# Altium project BW2098POE.PrjPcb (part 1 of 8)
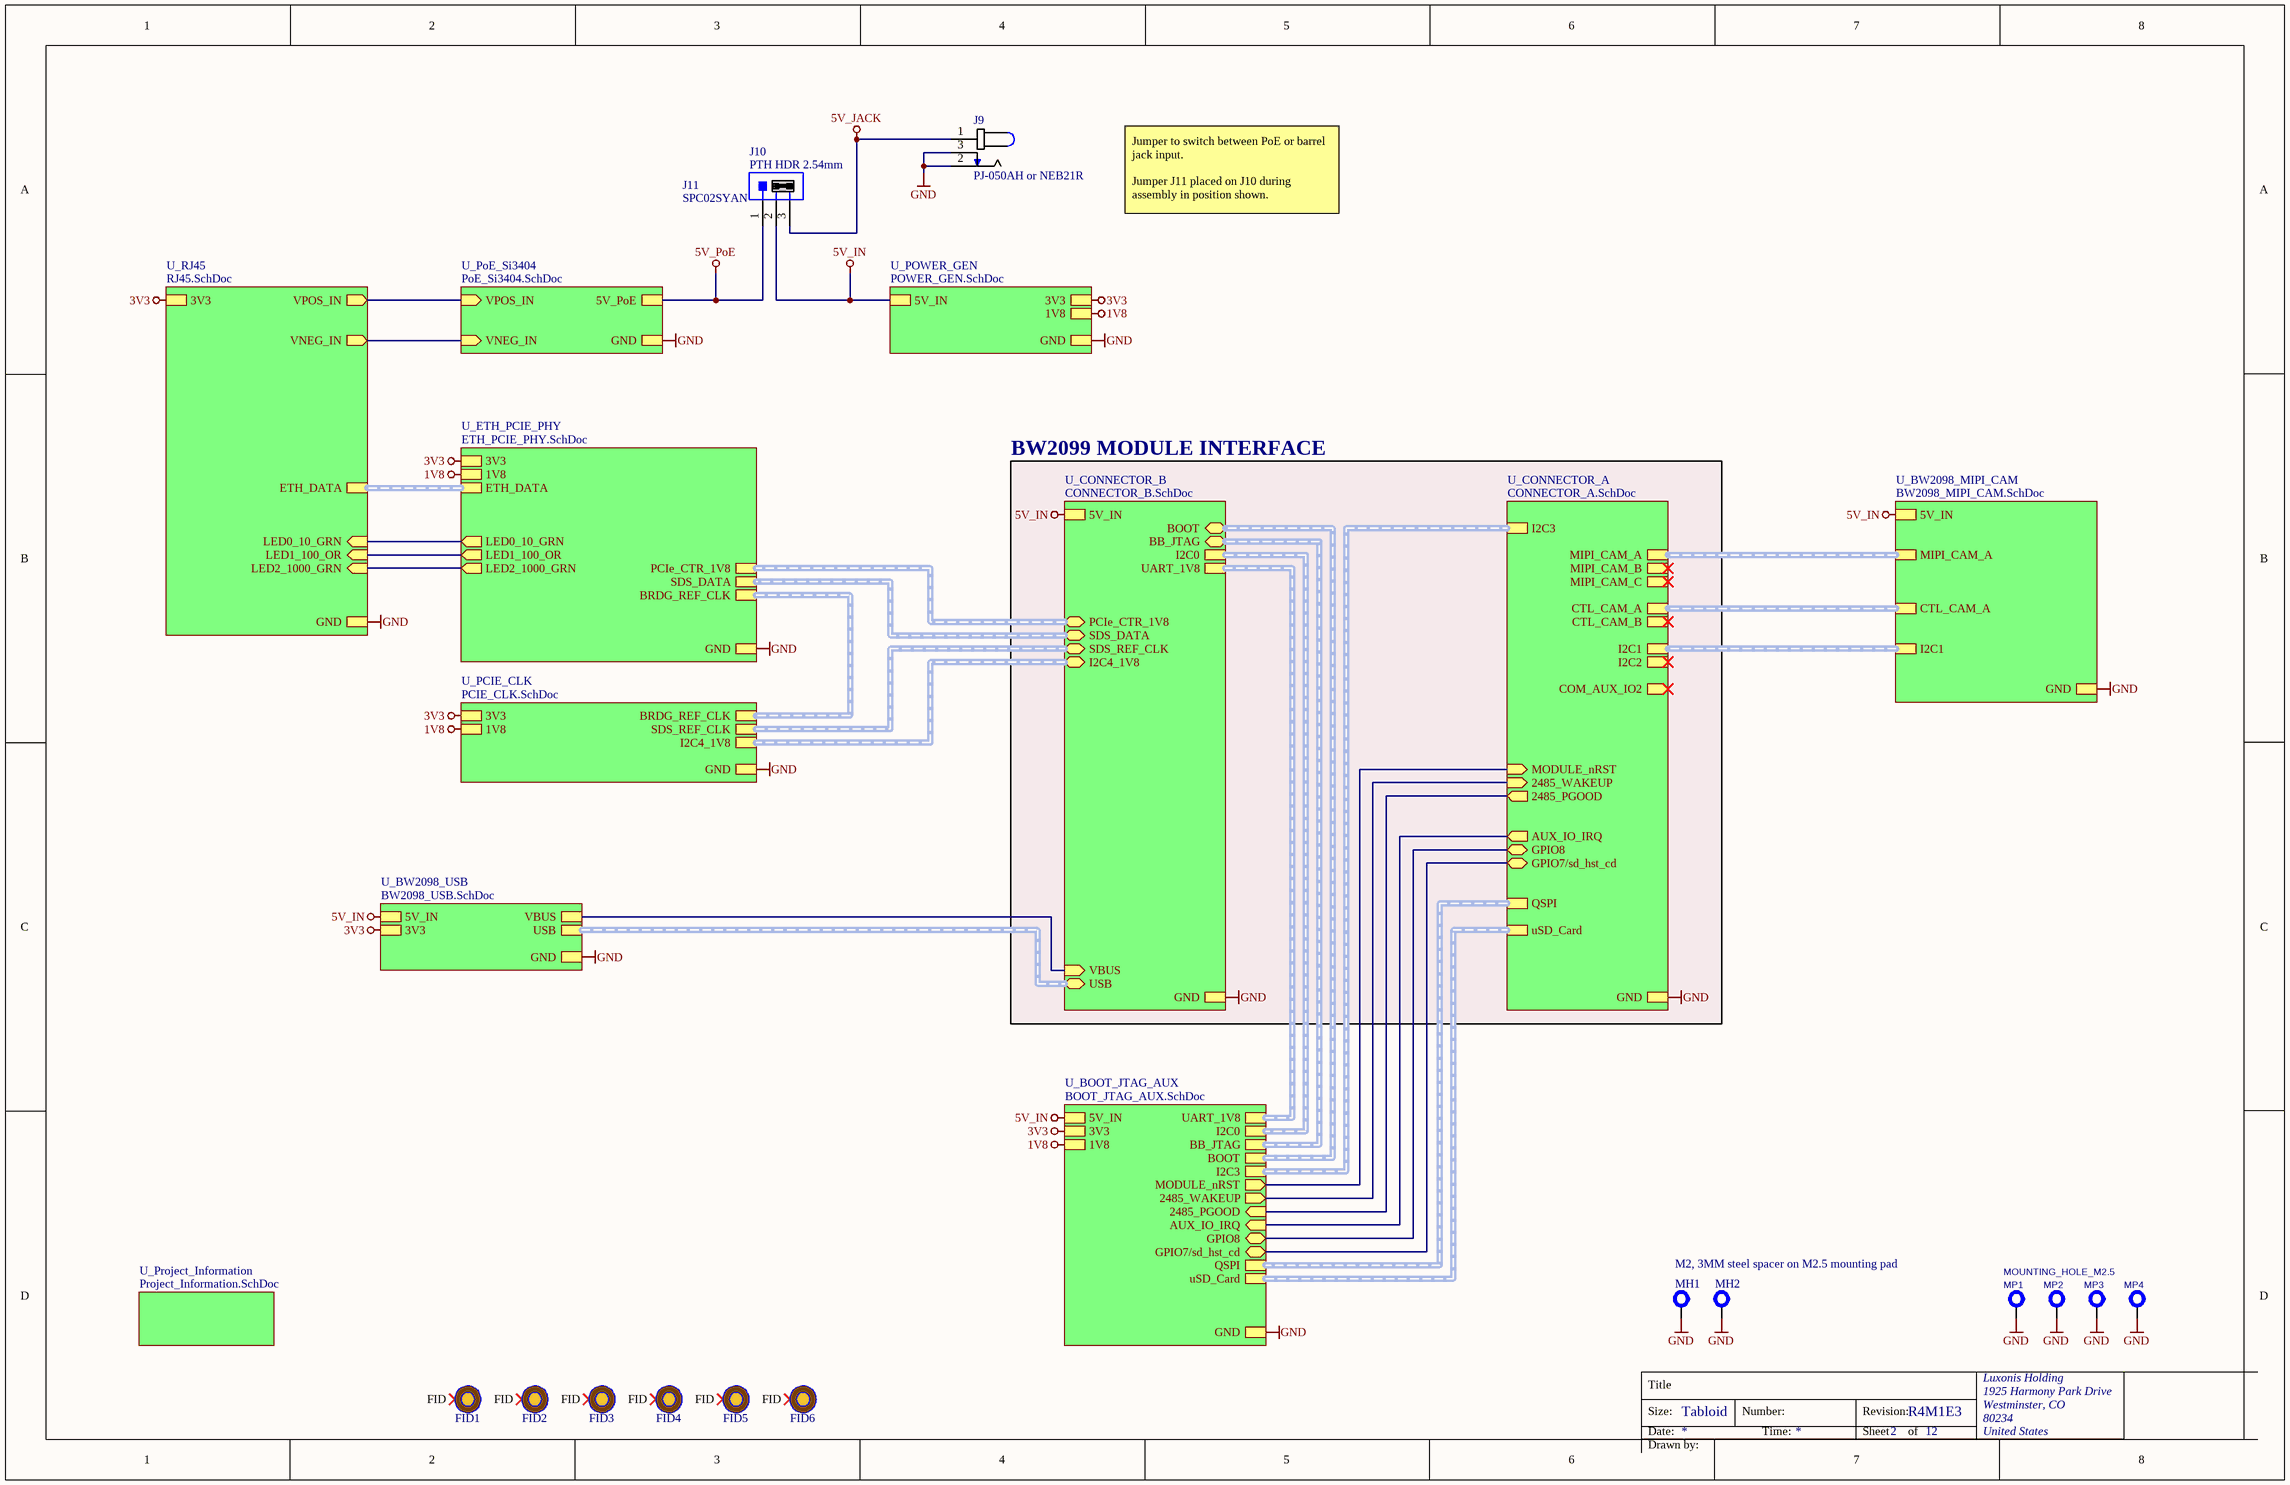
[diagram p0: TopLevel.SchDoc]
document_number: D2098000; drawn_by: Brian Weinstein; project_title: BW2098POE; revision: R4M1E3
12 sheets, 236 parts. Net scope: strictly hierarchical (ports join the sheet entries above them; power ports are local).
Board file: BW2098POE.PcbDoc
Sheets:
  TopLevel.SchDoc
    U_Project_Information = Project_Information.SchDoc
    U_CONNECTOR_B = CONNECTOR_B.SchDoc
    U_CONNECTOR_A = CONNECTOR_A.SchDoc
    U_ETH_PCIE_PHY = ETH_PCIE_PHY.SchDoc
    U_RJ45 = RJ45.SchDoc
    U_PCIE_CLK = PCIE_CLK.SchDoc
    U_BW2098_MIPI_CAM = BW2098_MIPI_CAM.SchDoc
    U_BW2098_USB = BW2098_USB.SchDoc
    U_BOOT_JTAG_AUX = BOOT_JTAG_AUX.SchDoc
    U_PoE_Si3404 = PoE_Si3404.SchDoc
    U_POWER_GEN = POWER_GEN.SchDoc

## Sheet TopLevel.SchDoc: =project_title
size Tabloid; CompanyName: Luxonis Holding; DrawnBy: Brian Weinstein; Organization: Luxonis Holding; Address1: 1925 Harmony Park Drive; Address2: Westminster, CO; Address3: 80234; Address4: United States; DocumentNumber: D2098000; Revision: R4M1E3; SheetNumber: 2; SheetTotal: 12

### Parts
FID1  FIDUCIAL_ROUND_1MM  [FIDUCIAL_ROUND_1MM]  (value not drawn)  (no BOM)
FID2  FIDUCIAL_ROUND_1MM  [FIDUCIAL_ROUND_1MM]  (value not drawn)  (no BOM)
FID3  FIDUCIAL_ROUND_1MM  [FIDUCIAL_ROUND_1MM]  (value not drawn)  (no BOM)
FID4  FIDUCIAL_ROUND_1MM  [FIDUCIAL_ROUND_1MM]  (value not drawn)  (no BOM)
FID5  FIDUCIAL_ROUND_1MM  [FIDUCIAL_ROUND_1MM]  (value not drawn)  (no BOM)
FID6  FIDUCIAL_ROUND_1MM  [FIDUCIAL_ROUND_1MM]  (value not drawn)  (no BOM)
J9  PJ-050AH or NEB21R  [PJ-050AH/NEB21R_COMBO]
J10  PTH HDR 2.54mm  [68000-103HLF]
J11  SPC02SYAN  [SPC02SYAN]
MH1  M2, 3MM steel spacer on M2.5 mounting pad  [9774030243R]
MH2  M2, 3MM steel spacer on M2.5 mounting pad  [9774030243R]  (value not drawn)
MP1  MOUNTING_HOLE_M2.5  [MOUNTING_HOLE_M2.5]  (no BOM)
MP2  MOUNTING_HOLE_M2.5  [MOUNTING_HOLE_M2.5]  (value not drawn)  (no BOM)
MP3  MOUNTING_HOLE_M2.5  [MOUNTING_HOLE_M2.5]  (value not drawn)  (no BOM)
MP4  MOUNTING_HOLE_M2.5  [MOUNTING_HOLE_M2.5]  (value not drawn)  (no BOM)

### Sub-sheets
U_BOOT_JTAG_AUX = BOOT_JTAG_AUX.SchDoc: GPIO8 (bidir), AUX_IO_IRQ (in), BOOT (harness BOOT), BB_JTAG (harness BB_JTAG), uSD_Card (harness uSD_Card), 2485_WAKEUP (out), QSPI (harness QSPI), I2C3 (harness I2C3), MODULE_nRST (out), UART_1V8 (harness UART_1V8), 2485_PGOOD (in), 1V8, 3V3, GND, 5V_IN, I2C0 (harness I2C0), GPIO7/sd_hst_cd (bidir)
U_BW2098_MIPI_CAM = BW2098_MIPI_CAM.SchDoc: I2C1 (harness I2C1), MIPI_CAM_A (harness MIPI_CAM_A), GND, 5V_IN, CTL_CAM_A (harness CTL_CAM_A)
U_BW2098_USB = BW2098_USB.SchDoc: USB (harness USB), GND, 5V_IN, 3V3, VBUS
U_CONNECTOR_A = CONNECTOR_A.SchDoc: AUX_IO_IRQ (out), I2C2 (harness I2C2), I2C1 (harness I2C1), QSPI (harness QSPI), uSD_Card (harness uSD_Card), MIPI_CAM_C (harness MIPI_CAM_C), CTL_CAM_A (harness CTL_CAM_A), MIPI_CAM_A (harness MIPI_CAM_A), MIPI_CAM_B (harness MIPI_CAM_B), GPIO8 (bidir), GND, I2C3 (harness I2C3), CTL_CAM_B (harness CTL_CAM_B), COM_AUX_IO2 (out), MODULE_nRST (in), 2485_WAKEUP (in), 2485_PGOOD (out), GPIO7/sd_hst_cd (bidir)
U_CONNECTOR_B = CONNECTOR_B.SchDoc: VBUS (in), UART_1V8 (harness UART_1V8), I2C0 (harness I2C0), 5V_IN, GND, BOOT (bidir, harness BOOT), PCIe_CTR_1V8 (bidir, harness PCIe_CTR_1V8), BB_JTAG (bidir, harness BB_JTAG), USB (bidir, harness USB), SDS_REF_CLK (bidir, harness SDS_REF_CLK), I2C4_1V8 (bidir, harness I2C4_1V8), SDS_DATA (bidir, harness Harness)
U_ETH_PCIE_PHY = ETH_PCIE_PHY.SchDoc: ETH_DATA (harness ETH_DATA), LED0_10_GRN (out), LED1_100_OR (out), LED2_1000_GRN (out), SDS_DATA (harness Harness), 3V3, GND, BRDG_REF_CLK (harness BRDG_REF_CLK), 1V8, PCIe_CTR_1V8 (harness PCIe_CTR_1V8)
U_PCIE_CLK = PCIE_CLK.SchDoc: BRDG_REF_CLK (harness BRDG_REF_CLK), SDS_REF_CLK (harness SDS_REF_CLK), GND, 3V3, 1V8, I2C4_1V8 (harness I2C4_1V8)
U_PoE_Si3404 = PoE_Si3404.SchDoc: 5V_PoE, GND, VPOS_IN (in), VNEG_IN (in)
U_POWER_GEN = POWER_GEN.SchDoc: GND, 3V3, 5V_IN, 1V8
U_Project_Information = Project_Information.SchDoc: no entries
U_RJ45 = RJ45.SchDoc: ETH_DATA (harness ETH_DATA), GND, LED0_10_GRN (in), 3V3, LED2_1000_GRN (in), LED1_100_OR (in), VPOS_IN (out), VNEG_IN (out)

### Nets
1V8: sheet U_ETH_PCIE_PHY/1V8, sheet U_PCIE_CLK/1V8, sheet U_BOOT_JTAG_AUX/1V8, sheet U_POWER_GEN/1V8
3V3: sheet U_ETH_PCIE_PHY/3V3, sheet U_RJ45/3V3, sheet U_PCIE_CLK/3V3, sheet U_BW2098_USB/3V3, sheet U_BOOT_JTAG_AUX/3V3, sheet U_POWER_GEN/3V3
5V_IN: J10.2 ; sheet U_CONNECTOR_B/5V_IN, sheet U_BW2098_MIPI_CAM/5V_IN, sheet U_BW2098_USB/5V_IN, sheet U_BOOT_JTAG_AUX/5V_IN, sheet U_POWER_GEN/5V_IN
5V_JACK: J9.1 J10.3
5V_PoE: J10.1 ; sheet U_PoE_Si3404/5V_PoE
GND: J9.2 J9.3 MH1.1 MH2.1 MP1.1 MP2.1 MP3.1 MP4.1 ; sheet U_CONNECTOR_B/GND, sheet U_CONNECTOR_A/GND, sheet U_ETH_PCIE_PHY/GND, sheet U_RJ45/GND, sheet U_PCIE_CLK/GND, sheet U_BW2098_MIPI_CAM/GND, sheet U_BW2098_USB/GND, sheet U_BOOT_JTAG_AUX/GND, sheet U_PoE_Si3404/GND, sheet U_POWER_GEN/GND
VBUS: sheet U_CONNECTOR_B/VBUS, sheet U_BW2098_USB/VBUS
VNEG_IN: sheet U_RJ45/VNEG_IN, sheet U_PoE_Si3404/VNEG_IN
2485_PGOOD: sheet U_CONNECTOR_A/2485_PGOOD, sheet U_BOOT_JTAG_AUX/2485_PGOOD
2485_WAKEUP: sheet U_CONNECTOR_A/2485_WAKEUP, sheet U_BOOT_JTAG_AUX/2485_WAKEUP
AUX_IO_IRQ: sheet U_CONNECTOR_A/AUX_IO_IRQ, sheet U_BOOT_JTAG_AUX/AUX_IO_IRQ
GPIO7/sd_hst_cd: sheet U_CONNECTOR_A/GPIO7/sd_hst_cd, sheet U_BOOT_JTAG_AUX/GPIO7/sd_hst_cd
GPIO8: sheet U_CONNECTOR_A/GPIO8, sheet U_BOOT_JTAG_AUX/GPIO8
LED0_10_GRN: sheet U_ETH_PCIE_PHY/LED0_10_GRN, sheet U_RJ45/LED0_10_GRN
LED1_100_OR: sheet U_ETH_PCIE_PHY/LED1_100_OR, sheet U_RJ45/LED1_100_OR
LED2_1000_GRN: sheet U_ETH_PCIE_PHY/LED2_1000_GRN, sheet U_RJ45/LED2_1000_GRN
MODULE_nRST: sheet U_CONNECTOR_A/MODULE_nRST, sheet U_BOOT_JTAG_AUX/MODULE_nRST
VPOS_IN: sheet U_RJ45/VPOS_IN, sheet U_PoE_Si3404/VPOS_IN

Not connected (* = marked no-connect by the designer): FID1 FID*; FID2 FID*; FID3 FID*; FID4 FID*; FID5 FID*; FID6 FID*

### Buses and harness runs
harness sheet U_BOOT_JTAG_AUX/BB_JTAG = sheet U_CONNECTOR_B/BB_JTAG
harness sheet U_BOOT_JTAG_AUX/BOOT = sheet U_CONNECTOR_B/BOOT
harness sheet U_BOOT_JTAG_AUX/I2C0 = sheet U_CONNECTOR_B/I2C0
harness sheet U_BOOT_JTAG_AUX/I2C3 = sheet U_CONNECTOR_A/I2C3
harness sheet U_BOOT_JTAG_AUX/QSPI = sheet U_CONNECTOR_A/QSPI
harness sheet U_BOOT_JTAG_AUX/UART_1V8 = sheet U_CONNECTOR_B/UART_1V8
harness sheet U_BOOT_JTAG_AUX/uSD_Card = sheet U_CONNECTOR_A/uSD_Card
harness sheet U_BW2098_MIPI_CAM/CTL_CAM_A = sheet U_CONNECTOR_A/CTL_CAM_A
harness sheet U_BW2098_MIPI_CAM/I2C1 = sheet U_CONNECTOR_A/I2C1
harness sheet U_BW2098_MIPI_CAM/MIPI_CAM_A = sheet U_CONNECTOR_A/MIPI_CAM_A
harness sheet U_BW2098_USB/USB = sheet U_CONNECTOR_B/USB
harness sheet U_CONNECTOR_B/I2C4_1V8 = sheet U_PCIE_CLK/I2C4_1V8
harness sheet U_CONNECTOR_B/PCIe_CTR_1V8 = sheet U_ETH_PCIE_PHY/PCIe_CTR_1V8
harness sheet U_CONNECTOR_B/SDS_DATA = sheet U_ETH_PCIE_PHY/SDS_DATA
harness sheet U_CONNECTOR_B/SDS_REF_CLK = sheet U_PCIE_CLK/SDS_REF_CLK
harness sheet U_ETH_PCIE_PHY/BRDG_REF_CLK = sheet U_PCIE_CLK/BRDG_REF_CLK
harness sheet U_ETH_PCIE_PHY/ETH_DATA = sheet U_RJ45/ETH_DATA

### Notes on the sheet
- Jumper to switch between PoE or barrel jack input.
  Jumper J11 placed on J10 during assembly in position shown.
- BW2099 MODULE INTERFACE
- Title
- Size:
- Date:
- Tabloid
- Number:
- Time:
- Revision:
- Sheet
- of
- Drawn by:

### Library data of the parts
FID1-FID6 = FIDUCIAL: Fiducial with various available footprints
J9 = PJ-050AH/NEB21R_COMBO: CONN POWER PIN 2 POS RA PTH Barrel jack 2.1mm x 5.5mm combo footprint; Manufacturer 1: CUI; Gender: Male; Shielding: Unshielded; Current Rating: 5A; Voltage Rating: 24V; Insulation Resistance: 100MR; Number of Conductors: 2; Max Current Rating: 3A; Voltage Rating (DC): 12V; Number of Ports: 1; Inside Diameter: 6mm; Supplier 1: Mouser; Manufacturer Part Number 1: PJ-050AH; Stock 1: 2665; Pricing 1: 1=0.78000, 10=0.68800, 50=0.62100, 100=0.59400, 1000=0.43200, 10000=0.39100 (USD); Mount: Through Hole; Color: Black; Contact Material: Copper; Contact Plating: Nickel; Housing Color: Black; Housing Material: Thermoplastic; Min Operating Temperature: -25°C; Max Operating Temperature: 85°C; Package Quantity: 500; Termination: Solder; Connector Type: Jack; Contact Gender: Male; Orientation: Horizontal; Lead Free: Lead Free; Flammability Rating: UL94 V-0; ComponentLink1URL: http://www.mouser.com/ds/2/670/PJ-050AH-524150.pdf?src-supplier=Mouser; ComponentLink1Description: http://www.mouser.com/ds/2/670/PJ-050AH-524150.pdf?src-supplier=Mouser; ComponentLink2URL: https://www.cui.com/product/resource/digikeypdf/pj-050ah.pdf?src-supplier=Digi-Key; ComponentLink2Description: https://www.cui.com/product/resource/digikeypdf/pj-050ah.pdf?src-supplier=Digi-Key; ComponentLink3URL: http://datasheet.octopart.com/PJ-050AH-CUI-datasheet-15696426.pdf?src-supplier=CUI; ComponentLink3Description: http://datasheet.octopart.com/PJ-050AH-CUI-datasheet-15696426.pdf?src-supplier=CUI; ComponentLink4URL: http://datasheet.octopart.com/PJ-050AH-CUI-datasheet-62089837.pdf?src-supplier=CUI; ComponentLink4Description: http://datasheet.octopart.com/PJ-050AH-CUI-datasheet-62089837.pdf?src-supplier=CUI; ComponentLink5URL: http://datasheet.octopart.com/PJ-050AH-CUI-datasheet-65972796.pdf?src-supplier=CUI; ComponentLink5Description: http://datasheet.octopart.com/PJ-050AH-CUI-datasheet-65972796.pdf?src-supplier=CUI; ComponentLink6URL: http://datasheet.octopart.com/PJ-050AH-CUI-datasheet-103766550.pdf?src-supplier=CUI; ComponentLink6Description: http://datasheet.octopart.com/PJ-050AH-CUI-datasheet-103766550.pdf?src-supplier=CUI; ComponentLink7URL: http://datasheet.octopart.com/PJ-050AH-CUI-datasheet-103111417.pdf?src-supplier=Electro+Sonic; ComponentLink7Description: http://datasheet.octopart.com/PJ-050AH-CUI-datasheet-103111417.pdf?src-supplier=Electro+Sonic; ComponentLink8URL: http://datasheet.octopart.com/PJ-050AH-CUI-datasheet-34390405.pdf?src-supplier=Future+Electronics; ComponentLink8Description: http://datasheet.octopart.com/PJ-050AH-CUI-datasheet-34390405.pdf?src-supplier=Future+Electronics; ComponentLink9URL: http://datasheet.octopart.com/PJ-050AH-CUI-datasheet-62073522.pdf?src-supplier=Future+Electronics; ComponentLink9Description: http://datasheet.octopart.com/PJ-050AH-CUI-datasheet-62073522.pdf?src-supplier=Future+Electronics; ComponentLink10URL: http://datasheet.octopart.com/PJ-050AH-CUI-datasheet-102985732.pdf?src-supplier=Future+Electronics; ComponentLink10Description: http://datasheet.octopart.com/PJ-050AH-CUI-datasheet-102985732.pdf?src-supplier=Future+Electronics; Supplier 2: Newark; Manufacturer 2: Lumberg; Manufacturer Part Number 2: NEB 21 R; Stock 2: 56; Pricing 2: 1=0.86400, 25=0.82100, 50=0.78300, 100=0.72900, 250=0.68600 (USD); Number of Pins: 2; Number of Terminals: 3; Packaging: Bulk; Max Voltage Rating (DC): 12V; Voltage Rating (AC): 12V; Length: 9mm; Depth: 14.5mm; REACH SVHC: No SVHC; ComponentLink11URL: https://datasheet.ciiva.com/11720/0900766b805694d6-11720273.pdf?src-supplier=RSComponents; ComponentLink11Description: https://datasheet.ciiva.com/11720/0900766b805694d6-11720273.pdf?src-supplier=RSComponents; ComponentLink12URL: https://datasheet.ciiva.com/1115/28897-1115898.pdf?src-supplier=Newark; ComponentLink12Description: https://datasheet.ciiva.com/1115/28897-1115898.pdf?src-supplier=Newark; ComponentLink13URL: https://datasheet.ciiva.com/8066/1700582-8066298.pdf?src-supplier=Element14; ComponentLink13Description: https://datasheet.ciiva.com/8066/1700582-8066298.pdf?src-supplier=Element14; ComponentLink14URL: https://datasheet.ciiva.com/29365/738882-da-01-ml-netzger-einbaukuppl-neb-21-r-de-en-fr-29365351.pdf?src-supplier=Conrad; ComponentLink14Description: https://datasheet.ciiva.com/29365/738882-da-01-ml-netzger-einbaukuppl-neb-21-r-de-en-fr-29365351.pdf?src-supplier=Conrad; ComponentLink15URL: http://datasheet.octopart.com/NEB-21-R-Lumberg-datasheet-15206778.pdf?src-supplier=Newark; ComponentLink15Description: http://datasheet.octopart.com/NEB-21-R-Lumberg-datasheet-15206778.pdf?src-supplier=Newark; ComponentLink16URL: http://datasheet.octopart.com/NEB-21-R-Lumberg-datasheet-103789672.pdf?src-supplier=Farnell; ComponentLink16Description: http://datasheet.octopart.com/NEB-21-R-Lumberg-datasheet-103789672.pdf?src-supplier=Farnell; ComponentLink17URL: http://datasheet.octopart.com/NEB-21-R-Lumberg-datasheet-136395310.pdf?src-supplier=Toby+Electronics; ComponentLink17Description: http://datasheet.octopart.com/NEB-21-R-Lumberg-datasheet-136395310.pdf?src-supplier=Toby+Electronics; Supplier Part Number 1: 490-PJ-050AH; Supplier Part Number 2: 97K6458; Supplier 3: Digi-Key; Supplier Part Number 3: CP-050AH-ND; Supplier 4: Element14; Supplier Part Number 4: 1217037
J10 = 68000-103HLF: Conn Unshrouded Header HDR 3 POS 2.54mm Solder ST Thru-Hole Bulk; Manufacturer 1: Amphenol FCI; Number of Positions: 3; Connector Type: Male Pin; Current Rating: 3A; Voltage Rating: 1.5kV; Insulation Resistance: 5GR; Gender: Male; Contact Post Length: 2.41mm; Supplier 1: Digi-Key; Manufacturer Part Number 1: 68000-103HLF; RoHS: Yes; Category: Headers and Wire Housings; Stock 1: 28978; Pricing 1: 1=0.29000, 10=0.27900, 100=0.19500, 500=0.16716, 1000=0.13930, 5000=0.11940, 10000=0.11144 (USD); Mount: Through Hole; Contact Plating: Gold,GXT; Contact Material: Bronze; Color: Black; Housing Color: Black; Housing Material: Thermoplastic; Min Operating Temperature: -65°C; Max Operating Temperature: 125°C; Number of Rows: 1; Termination: Through Hole; Packaging: Bulk; Number of Contacts: 3; Contact Gender: Male; Package Quantity: 100; Max Voltage Rating (AC): 1.5kV; Orientation: Straight; Length: 7.62mm; Pitch: 2.54mm; Contact Mating Length: 5.84mm; Depth: 2.41mm; Radiation Hardening: No; Flammability Rating: UL94 V-0; REACH SVHC: No SVHC; ComponentLink1URL: https://datasheet.ciiva.com/5157/68000-274283-5157301.pdf?src-supplier=Mouser; ComponentLink1Description: https://datasheet.ciiva.com/5157/68000-274283-5157301.pdf?src-supplier=Mouser; ComponentLink2URL: https://datasheet.ciiva.com/46392/1914865-46392021.pdf?src-supplier=Element14; ComponentLink2Description: https://datasheet.ciiva.com/46392/1914865-46392021.pdf?src-supplier=Element14; ComponentLink3URL: https://datasheet.ciiva.com/10149/68000-10149754.pdf?src-supplier=Avnet; ComponentLink3Description: https://datasheet.ciiva.com/10149/68000-10149754.pdf?src-supplier=Avnet; Supplier 2: Avnet; Supplier 3: Mouser; Supplier Part Number 1: 609-3461-ND; Supplier Part Number 2: 68000-103HLF; Supplier Part Number 3: 649-68000-103HLF
J11 = SPC02SYAN: CONN JUMPER SHORTING GOLD FLASH; Manufacturer 1: Sullins; Number of Positions: 2; Pitch: 0.1inch; Supplier 1: Digi-Key; Manufacturer Part Number 1: SPC02SYAN; RoHS: Yes; Category: Connectors; Stock 1: 308371; Pricing 1: 1=0.10000, 10=0.05900, 25=0.04400, 50=0.03780, 100=0.03650, 250=0.03152, 500=0.03024, 1000=0.02646, 2500=0.02394 (USD); Color: Black; Contact Plating: Gold; Package Quantity: 1000; Packaging: Bulk; Height: 0.256inch; Lead Free: Lead Free; ComponentLink1URL: https://datasheet.ciiva.com/16203/spc02syan-0-3293-16203044.pdf?src-supplier=Future+Electronics; ComponentLink1Description: https://datasheet.ciiva.com/16203/spc02syan-0-3293-16203044.pdf?src-supplier=Future+Electronics; ComponentLink2URL: https://datasheet.ciiva.com/767/134-c02syan-11134-767878.pdf?src-supplier=Digi-Key; ComponentLink2Description: https://datasheet.ciiva.com/767/134-c02syan-11134-767878.pdf?src-supplier=Digi-Key; Supplier Part Number 1: S9001-ND; Supplier 2: Future Electronics; Supplier Part Number 2: SPC02SYAN-BAG
MH1 MH2 = 9774030243R: MP ROUND STANDOFF M2X0.4 STEEL 3MM; Manufacturer 1: Wurth Electronics; Plating: Tin; Threaded/Unthreaded: Threaded; Outside Diameter: 0.171inch; Supplier 1: Digi-Key; Manufacturer Part Number 1: 9774030243R; Stock 1: 20568; Pricing 1: 1=0.95000, 10=0.91800, 50=0.79500, 100=0.73900 (USD); RoHS: Yes; Material: Steel; Length: 0.173inch; REACH SVHC: Unknown; ComponentLink1URL: http://www.mouser.com/ds/2/445/9774030243R-611455.pdf?src-supplier=Mouser; ComponentLink1Description: http://www.mouser.com/ds/2/445/9774030243R-611455.pdf?src-supplier=Mouser; ComponentLink2URL: http://www.farnell.com/datasheets/1960368.pdf?src-supplier=Farnell; ComponentLink2Description: http://www.farnell.com/datasheets/1960368.pdf?src-supplier=Farnell; ComponentLink3URL: https://katalog.we-online.de/em/datasheet/9774030243R.pdf?src-supplier=Digi-Key; ComponentLink3Description: https://katalog.we-online.de/em/datasheet/9774030243R.pdf?src-supplier=Digi-Key; ComponentLink4URL: http://www.farnell.com/datasheets/1960368.pdf?src-supplier=Newark; ComponentLink4Description: http://www.farnell.com/datasheets/1960368.pdf?src-supplier=Newark; ComponentLink5URL: http://www.farnell.com/datasheets/1960368.pdf?src-supplier=Element14; ComponentLink5Description: http://www.farnell.com/datasheets/1960368.pdf?src-supplier=Element14; Supplier Part Number 1: 732-7085-1-ND; Supplier 2: Mouser; Supplier Part Number 2: 710-9774030243R; Supplier 3: Element14; Supplier Part Number 3: 2497599
MP1-MP4 = MP_Mounting-Holes: =CurrentFootprint; B - Value: Not a Part; A - Level: 0

## Sheet Project_Information.SchDoc: =project_title
size Tabloid; CompanyName: Luxonis Holding; DrawnBy: Brian Weinstein; Organization: Luxonis Holding; Address1: 1925 Harmony Park Drive; Address2: Westminster, CO; Address3: 80234; Address4: United States; DocumentNumber: D2098000; Revision: R4M1E3; SheetNumber: 1; SheetTotal: 12
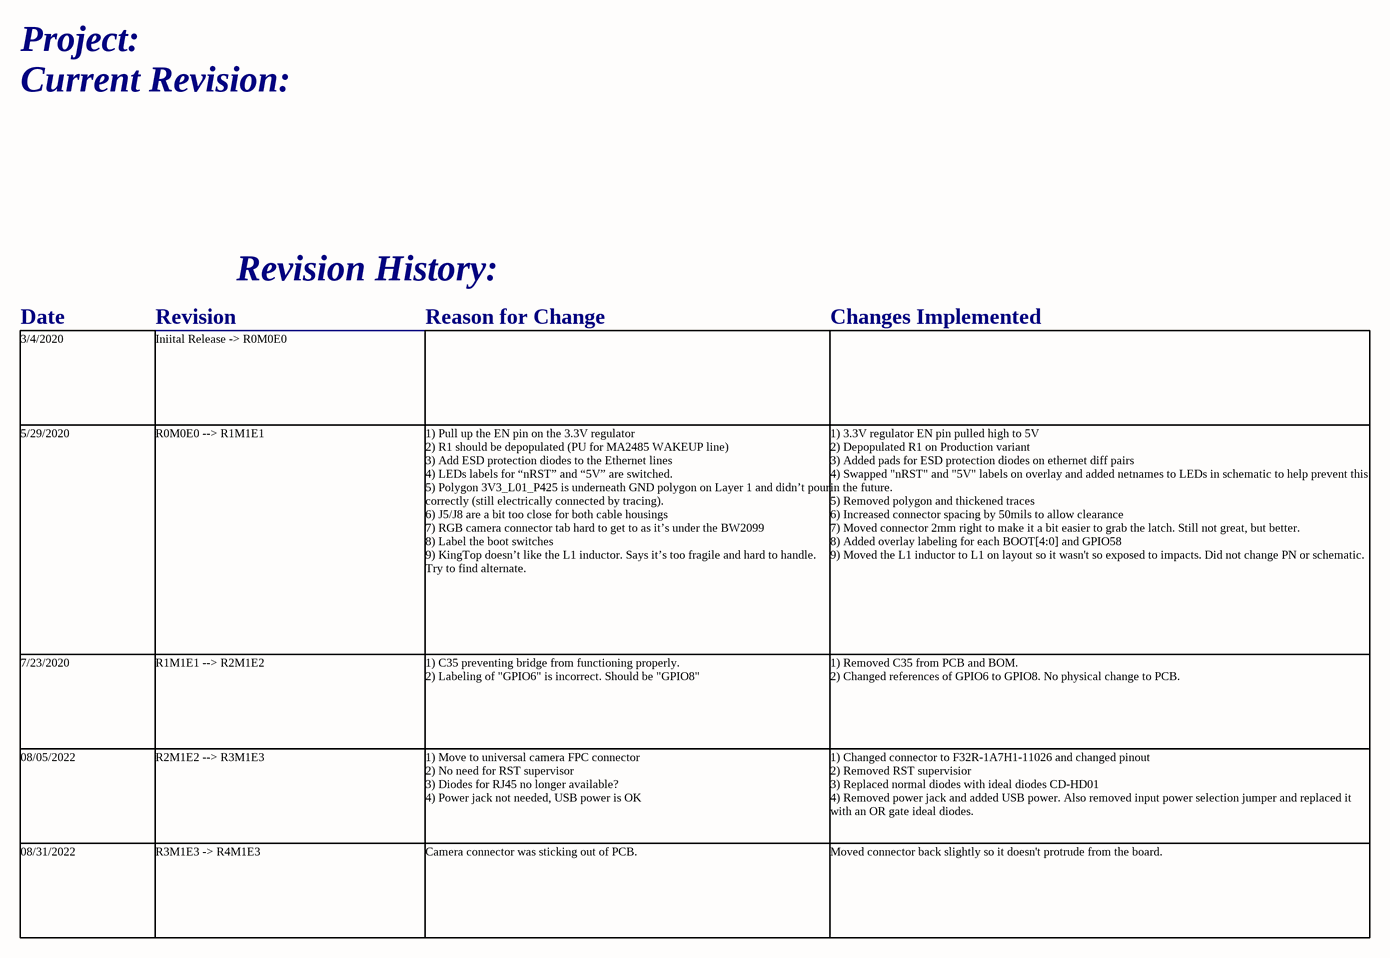
[diagram p1: Project_Information.SchDoc]

### Notes on the sheet
- Project:
- Current Revision:
- Revision History:
- Date
- Revision
- Reason for Change
- Changes Implemented
- 3/4/2020
- Iniital Release -> R0M0E0
- 5/29/2020
- R0M0E0 --> R1M1E1
- 1) Pull up the EN pin on the 3.3V regulator
  2) R1 should be depopulated (PU for MA2485 WAKEUP line)
  3) Add ESD protection diodes to the Ethernet lines
  4) LEDs labels for “nRST” and “5V” are switched.
  5) Polygon 3V3_L01_P425 is underneath GND polygon on Layer 1 and didn’t pour correctly (still electrically connected by tracing).
  6) J5/J8 are a bit too close for both cable housings
  7) RGB camera connector tab hard to get to as it’s under the BW2099
  8) Label the boot switches
  9) KingTop doesn’t like the L1 inductor. Says it’s too fragile and hard to handle. Try to find alternate.
- 1) 3.3V regulator EN pin pulled high to 5V
  2) Depopulated R1 on Production variant
  3) Added pads for ESD protection diodes on ethernet diff pairs
  4) Swapped "nRST" and "5V" labels on overlay and added netnames to LEDs in schematic to help prevent this in the future.
  5) Removed polygon and thickened traces
  6) Increased connector spacing by 50mils to allow clearance
  7) Moved connector 2mm right to make it a bit easier to grab the latch. Still not great, but better.
  8) Added overlay labeling for each BOOT[4:0] and GPIO58
  9) Moved the L1 inductor to L1 on layout so it wasn't so exposed to impacts. Did not change PN or schematic.
- 7/23/2020
- R1M1E1 --> R2M1E2
- 1) C35 preventing bridge from functioning properly.
  2) Labeling of "GPIO6" is incorrect. Should be "GPIO8"
- 1) Removed C35 from PCB and BOM.
  2) Changed references of GPIO6 to GPIO8. No physical change to PCB.
- 08/05/2022
- R2M1E2 --> R3M1E3
- 1) Move to universal camera FPC connector
  2) No need for RST supervisor
  3) Diodes for RJ45 no longer available?
  4) Power jack not needed, USB power is OK
- 1) Changed connector to F32R-1A7H1-11026 and changed pinout
  2) Removed RST supervisior
  3) Replaced normal diodes with ideal diodes CD-HD01
  4) Removed power jack and added USB power. Also removed input power selection jumper and replaced it with an OR gate ideal diodes.
- 08/31/2022
- R3M1E3 -> R4M1E3
- Camera connector was sticking out of PCB.
- Moved connector back slightly so it doesn't protrude from the board.
- Title
- Size:
- Date:
- Tabloid
- Number:
- Time:
- Revision:
- Sheet
- of
- Drawn by:

## Sheet CONNECTOR_B.SchDoc: =project_title
size Tabloid; CompanyName: Luxonis Holding; DrawnBy: Brian Weinstein; Organization: Luxonis Holding; Address1: 1925 Harmony Park Drive; Address2: Westminster, CO; Address3: 80234; Address4: United States; DocumentNumber: D2098000; SheetNumber: 6; SheetTotal: 12
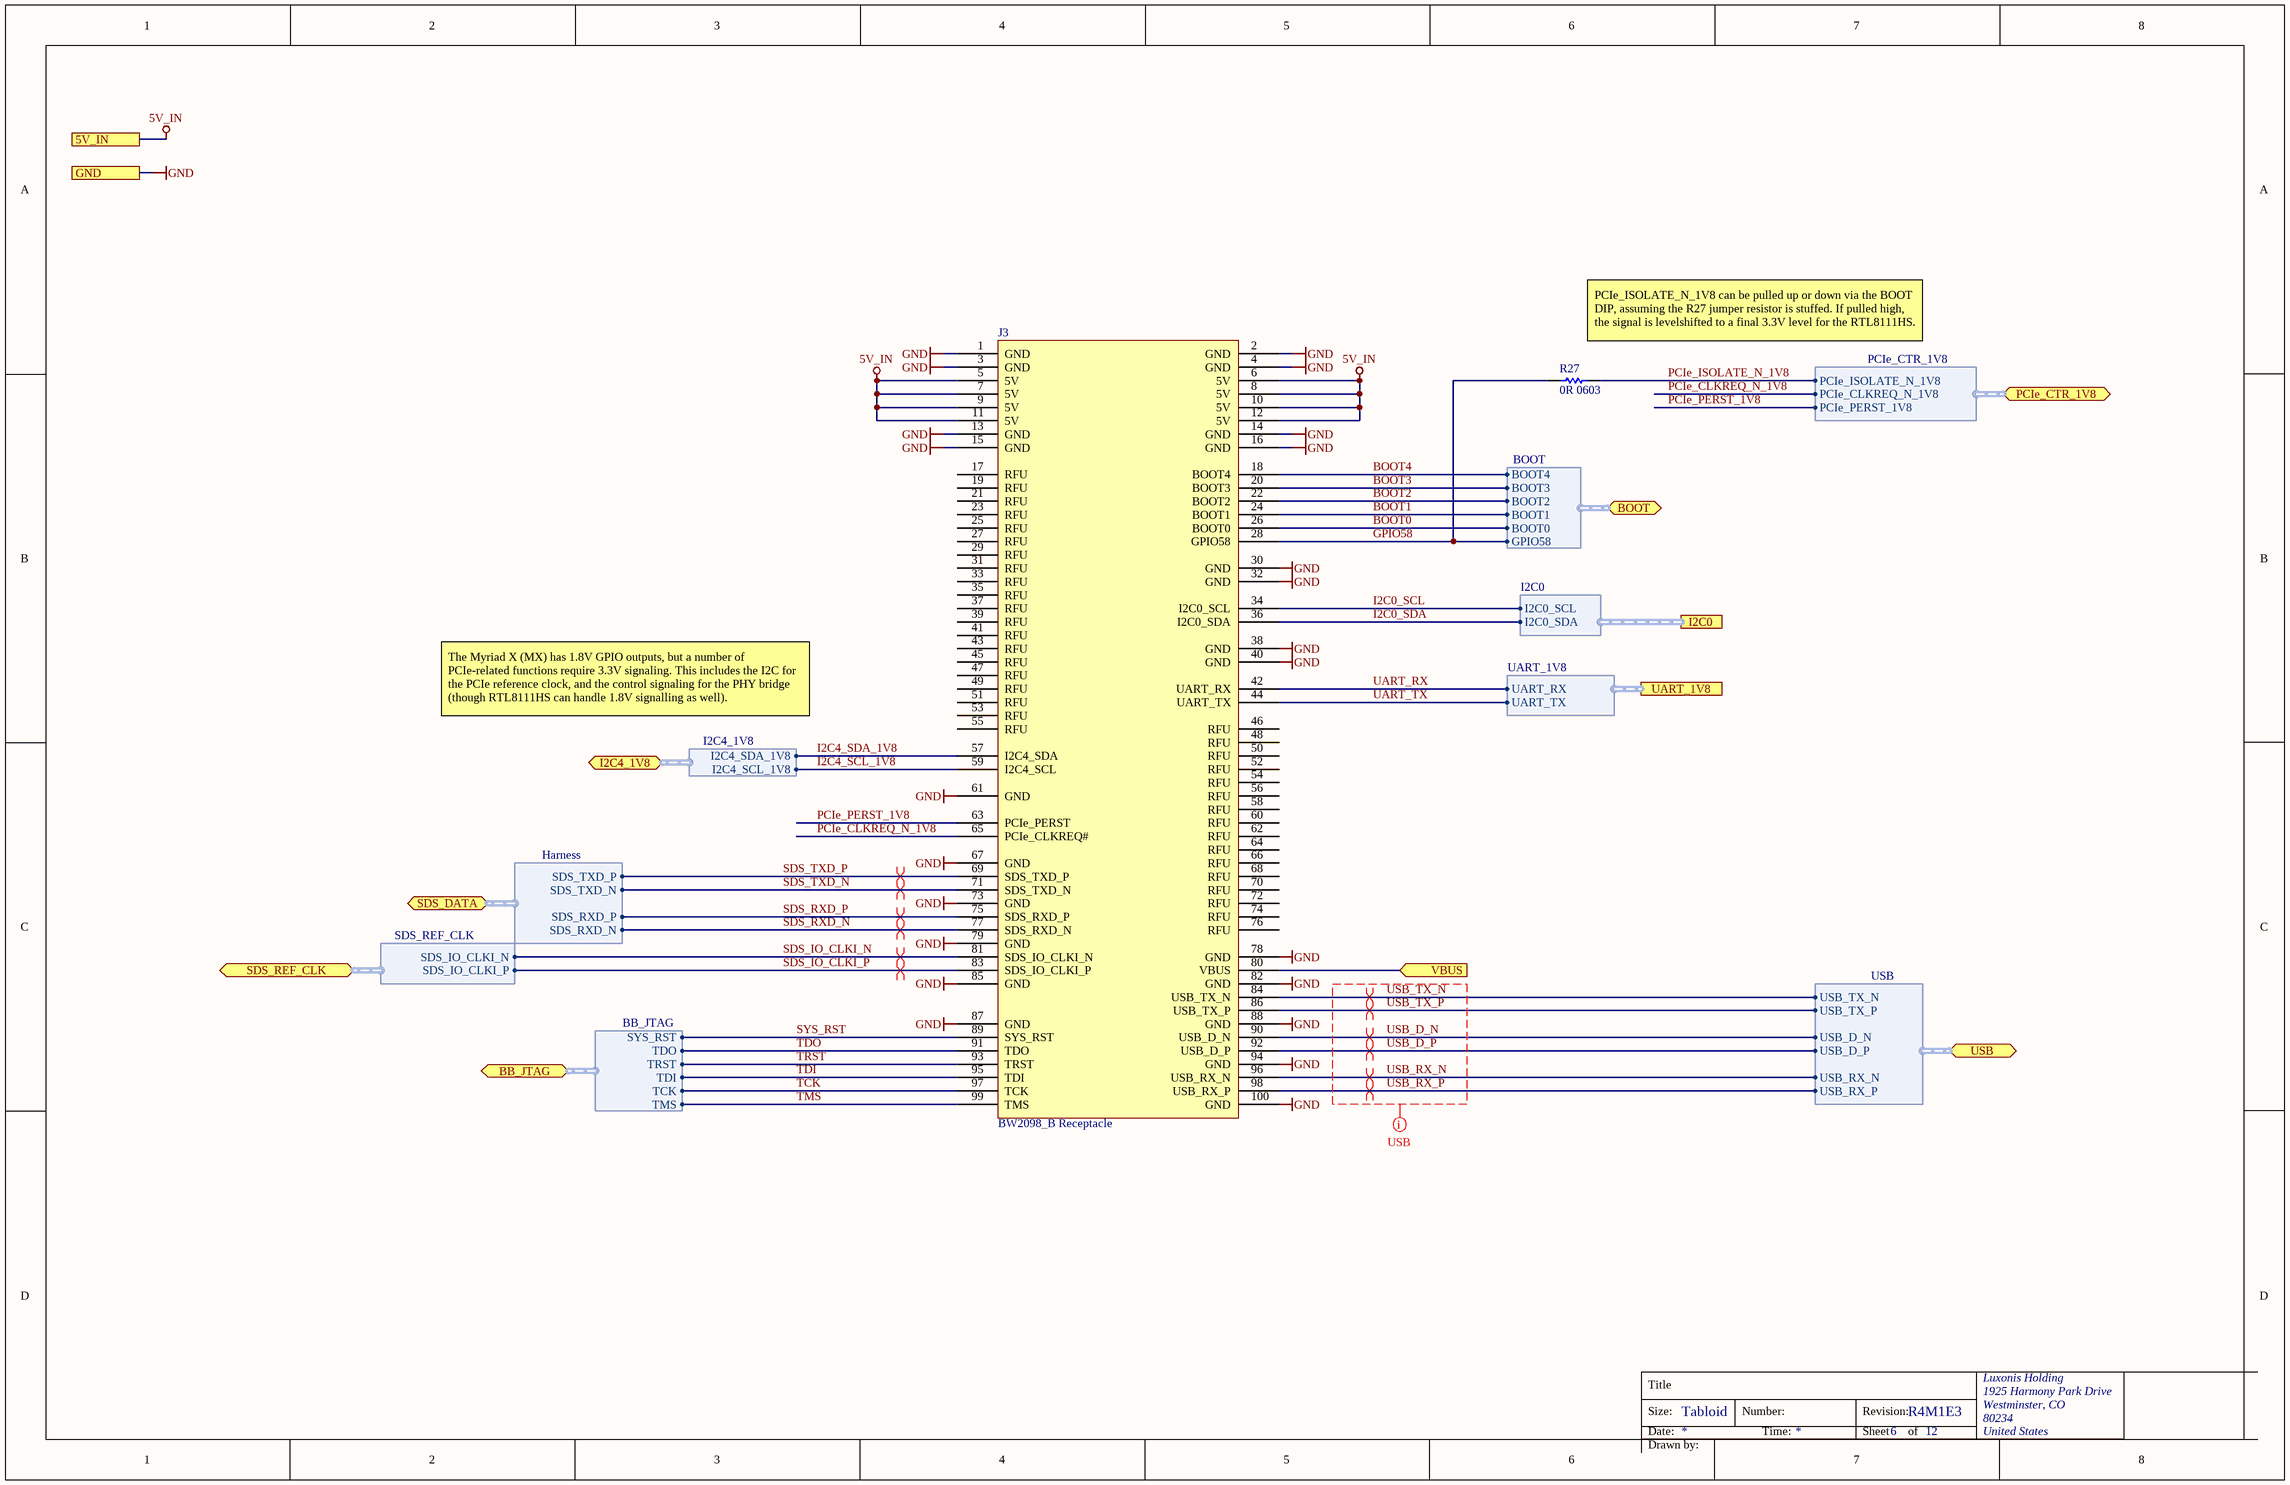
[diagram p2: CONNECTOR_B.SchDoc]

### Parts
J3  BW2098_B Receptacle  [DF40HC-3.0-100DS-0.4V_minpad]
R27  0R 0603  [RESC0603(1608)_N]

### Ports
5V_IN, BB_JTAG (bidir, harness BB_JTAG), BOOT (bidir, harness BOOT), GND, I2C0 (harness I2C0), I2C4_1V8 (bidir, harness I2C4_1V8), PCIe_CTR_1V8 (bidir, harness PCIe_CTR_1V8), SDS_DATA (bidir, harness Harness), SDS_REF_CLK (bidir, harness SDS_REF_CLK), UART_1V8 (harness UART_1V8), USB (bidir, harness USB), VBUS (in)

### Harnesses
USB: USB_RX_P, USB_RX_N, USB_D_P, USB_D_N, USB_TX_P, USB_TX_N
BOOT: BOOT4, BOOT3, BOOT2, BOOT1, BOOT0, GPIO58
I2C0: I2C0_SDA, I2C0_SCL
UART_1V8: UART_RX, UART_TX
BB_JTAG: SYS_RST, TDO, TRST, TDI, TCK, TMS
SDS_REF_CLK: SDS_IO_CLKI_P, SDS_IO_CLKI_N
Harness: SDS_TXD_P, SDS_TXD_N, SDS_RXD_P, SDS_RXD_N
I2C4_1V8: I2C4_SDA_1V8, I2C4_SCL_1V8
PCIe_CTR_1V8: PCIe_CLKREQ_N_1V8, PCIe_ISOLATE_N_1V8, PCIe_PERST_1V8

### Nets
5V_IN: J3.5(5V) J3.6(5V) J3.7(5V) J3.8(5V) J3.9(5V) J3.10(5V) J3.11(5V) J3.12(5V) ; port 5V_IN
GND: J3.1(GND) J3.2(GND) J3.3(GND) J3.4(GND) J3.13(GND) J3.14(GND) J3.15(GND) J3.16(GND) J3.30(GND) J3.32(GND) J3.38(GND) J3.40(GND) J3.61(GND) J3.67(GND) J3.73(GND) J3.78(GND) J3.79(GND) J3.82(GND) J3.85(GND) J3.87(GND) J3.88(GND) J3.94(GND) J3.100(GND) ; port GND
VBUS: J3.80(VBUS) ; port VBUS
BOOT0: J3.26(BOOT0) ; port BOOT.BOOT0
BOOT1: J3.24(BOOT1) ; port BOOT.BOOT1
BOOT2: J3.22(BOOT2) ; port BOOT.BOOT2
BOOT3: J3.20(BOOT3) ; port BOOT.BOOT3
BOOT4: J3.18(BOOT4) ; port BOOT.BOOT4
GPIO58: J3.28(GPIO58) R27.1 ; port BOOT.GPIO58
I2C0_SCL: J3.34(I2C0_SCL) ; port I2C0.I2C0_SCL
I2C0_SDA: J3.36(I2C0_SDA) ; port I2C0.I2C0_SDA
I2C4_SCL_1V8: J3.59(I2C4_SCL) ; port I2C4_1V8.I2C4_SCL_1V8
I2C4_SDA_1V8: J3.57(I2C4_SDA) ; port I2C4_1V8.I2C4_SDA_1V8
PCIe_CLKREQ_N_1V8: J3.65(PCIe_CLKREQ#) ; port PCIe_CTR_1V8.PCIe_CLKREQ_N_1V8
PCIe_ISOLATE_N_1V8: R27.2 ; port PCIe_CTR_1V8.PCIe_ISOLATE_N_1V8
PCIe_PERST_1V8: J3.63(PCIe_PERST) ; port PCIe_CTR_1V8.PCIe_PERST_1V8
SDS_IO_CLKI_N: J3.81(SDS_IO_CLKI_N) ; port SDS_REF_CLK.SDS_IO_CLKI_N
SDS_IO_CLKI_P: J3.83(SDS_IO_CLKI_P) ; port SDS_REF_CLK.SDS_IO_CLKI_P
SDS_RXD_N: J3.77(SDS_RXD_N) ; port SDS_DATA.SDS_RXD_N
SDS_RXD_P: J3.75(SDS_RXD_P) ; port SDS_DATA.SDS_RXD_P
SDS_TXD_N: J3.71(SDS_TXD_N) ; port SDS_DATA.SDS_TXD_N
SDS_TXD_P: J3.69(SDS_TXD_P) ; port SDS_DATA.SDS_TXD_P
SYS_RST: J3.89(SYS_RST) ; port BB_JTAG.SYS_RST
TCK: J3.97(TCK) ; port BB_JTAG.TCK
TDI: J3.95(TDI) ; port BB_JTAG.TDI
TDO: J3.91(TDO) ; port BB_JTAG.TDO
TMS: J3.99(TMS) ; port BB_JTAG.TMS
TRST: J3.93(TRST) ; port BB_JTAG.TRST
UART_RX: J3.42(UART_RX) ; port UART_1V8.UART_RX
UART_TX: J3.44(UART_TX) ; port UART_1V8.UART_TX
USB_D_N: J3.90(USB_D_N) ; port USB.USB_D_N
USB_D_P: J3.92(USB_D_P) ; port USB.USB_D_P
USB_RX_N: J3.96(USB_RX_N) ; port USB.USB_RX_N
USB_RX_P: J3.98(USB_RX_P) ; port USB.USB_RX_P
USB_TX_N: J3.84(USB_TX_N) ; port USB.USB_TX_N
USB_TX_P: J3.86(USB_TX_P) ; port USB.USB_TX_P

Not connected (* = marked no-connect by the designer): J3 17(RFU) 19(RFU) 21(RFU) 23(RFU) 25(RFU) 27(RFU) 29(RFU) 31(RFU) 33(RFU) 35(RFU) 37(RFU) 39(RFU) 41(RFU) 43(RFU) 45(RFU) 46(RFU) 47(RFU) 48(RFU) 49(RFU) 50(RFU) 51(RFU) 52(RFU) 53(RFU) 54(RFU) 55(RFU) 56(RFU) 58(RFU) 60(RFU) 62(RFU) 64(RFU) 66(RFU) 68(RFU) 70(RFU) 72(RFU) 74(RFU) 76(RFU)

### Layout directives
net class USB: USB_D_N, USB_D_P, USB_RX_N, USB_RX_P, USB_TX_N, USB_TX_P
differential pair; differential pair class 85ohm: SDS_IO_CLKI_N, SDS_IO_CLKI_P, SDS_RXD_N, SDS_RXD_P, SDS_TXD_N, SDS_TXD_P
differential pair; differential pair class USB3: USB_D_N, USB_D_P, USB_RX_N, USB_RX_P, USB_TX_N, USB_TX_P

### Notes on the sheet
- PCIe_ISOLATE_N is wired up on the MV0247 via GPIO58, but does not exist in the MV0235 design.
- (near R27) PCIe_ISOLATE_N_1V8 can be pulled up or down via the BOOT DIP, assuming the R27 jumper resistor is stuffed. If pulled high, the signal is levelshifted to a final 3.3V level for the RTL8111HS.
- The Myriad X (MX) has 1.8V GPIO outputs, but a number of PCIe-related functions require 3.3V signaling. This includes the I2C for the PCIe reference clock, and the control signaling for the PHY bridge (though RTL8111HS can handle 1.8V signalling as well).
- Title
- Size:
- Date:
- Tabloid
- Number:
- Time:
- Revision:
- Sheet
- of
- Drawn by:

### Library data of the parts
J3 = DF40HC(3.0)-100DS-0.4V_BW2098_B: CONN RCPT 100POS 0.4MM SMD GOLD BW2098_B Receptacle; Manufacturer 1: Hirose; Number of Positions: 100; Pitch: 0.016inch; System: Connector; RoHS: Yes; Mount: Surface Mount; Contact Plating: Gold; Packaging: Tape and Reel; Number of Rows: 2; Package Quantity: 1000; Connector Type: Receptacle; Lead Free: Lead Free; ComponentLink1URL: https://datasheet.ciiva.com/46636/ed-df40-20140305-46636517.pdf?src-supplier=Digi-Key; ComponentLink1Description: https://datasheet.ciiva.com/46636/ed-df40-20140305-46636517.pdf?src-supplier=Digi-Key; ComponentLink2URL: https://datasheet.ciiva.com/18562/ed-df40-20140305-18562189.pdf?src-supplier=Digi-Key; ComponentLink2Description: https://datasheet.ciiva.com/18562/ed-df40-20140305-18562189.pdf?src-supplier=Digi-Key; ComponentLink3URL: https://datasheet.ciiva.com/13559/ed-df40-20140305-13559540.pdf?src-supplier=Mouser; ComponentLink3Description: https://datasheet.ciiva.com/13559/ed-df40-20140305-13559540.pdf?src-supplier=Mouser; ComponentLink4URL: https://datasheet.ciiva.com/18562/ed-df40-20140305-18562462.pdf?src-supplier=Digi-Key; ComponentLink4Description: https://datasheet.ciiva.com/18562/ed-df40-20140305-18562462.pdf?src-supplier=Digi-Key; Supplier 1: Mouser; Stock 1: 2172; Pricing 1: 1=2.54000, 10=2.26000, 25=2.07000, 50=2.07000, 100=1.98000, 250=1.79000, 500=1.65000, 1000=1.41000, 3000=1.32000, 6000=1.23000, 10000=1.23000 (USD); Supplier 2: Mouser; Manufacturer 2: Hirose; Manufacturer Part Number 2: DF40HC(3.0)-100DS-0.4V(58); Stock 2: 2078; Pricing 2: 1=2.50000, 10=2.40000, 25=2.10000, 50=2.10000, 100=2.00000, 250=1.76000, 500=1.71000, 1000=1.45000, 2000=1.36000, 5000=1.31000, 10000=1.31000 (USD); Supplier Part Number 1: 798-DF40HC30100DS451; Supplier Part Number 2: 798-DF40HC30100DS458
R27 = CRCW06030000Z0EA: RES SMD 0 OHM JUMPER 1/10W 0603 0 Ohms Jumper 0.1W, 1/10W Chip Resistor 0603 (1608 Metric) Automotive AEC-Q200 Thick Film; Manufacturer 1: Vishay; Manufacturer Part Number 1: CRCW0603-0000Z0EA; Resistance: 0mR; Power Rating: 100mW; Voltage Rating: 75V; Temperature Coefficient: 100ppm/°C; Tolerance: 5%; Current Rating: 2A; Supplier 1: Digi-Key; Stock 1: 742743; Pricing 1: 1=0.100000, 10=0.034000, 25=0.024400, 50=0.018600, 100=0.013800, 250=0.010480, 500=0.008400, 1000=0.006180 (USD); RoHS: Yes; Mount: Surface Mount; Case/Package: 0603; Weight: 7.1E-05oz; Contact Plating: Tin,Lead; Case Code (Metric): 1608; Case Code (Imperial): 0603; Min Operating Temperature: -55°C; Max Operating Temperature: 155°C; Composition: Thick Film; Termination: SMD/SMT; Packaging: Tape and Reel; Package Quantity: 1; Number of Terminations: 2; Military Standard: Not; Max Power Dissipation: 100mW; Voltage Rating (DC): 75V; Features: Automotive AEC-Q200; Working Voltage: 75V; Length: 1.55mm; Height: 0.02inch; Width: 0.033inch; Depth: 0.85mm; Radiation Hardening: No; Lead Free: Lead Free; REACH SVHC: Unknown; ComponentLink1URL: https://datasheet.ciiva.com/2461/dcrcwe3-2461968.pdf?src-supplier=Digi-Key; ComponentLink1Description: https://datasheet.ciiva.com/2461/dcrcwe3-2461968.pdf?src-supplier=Digi-Key; ComponentLink2URL: https://datasheet.ciiva.com/2461/dcrcwe3-2461969.pdf?src-supplier=Digi-Key; ComponentLink2Description: https://datasheet.ciiva.com/2461/dcrcwe3-2461969.pdf?src-supplier=Digi-Key; ComponentLink3URL: https://datasheet.ciiva.com/2461/dcrcwe3-2461970.pdf?src-supplier=Digi-Key; ComponentLink3Description: https://datasheet.ciiva.com/2461/dcrcwe3-2461970.pdf?src-supplier=Digi-Key; ComponentLink4URL: https://datasheet.ciiva.com/8340/dcrcwe3-8340197.pdf?src-supplier=Avnet; ComponentLink4Description: https://datasheet.ciiva.com/8340/dcrcwe3-8340197.pdf?src-supplier=Avnet; ComponentLink5URL: https://datasheet.ciiva.com/16941/dcrcw-16941302.pdf?src-supplier=Avnet+Europe; ComponentLink5Description: https://datasheet.ciiva.com/16941/dcrcw-16941302.pdf?src-supplier=Avnet+Europe; ComponentLink6URL: https://datasheet.ciiva.com/16199/dcrcwe3-16199063.pdf?src-supplier=Future+Electronics; ComponentLink6Description: https://datasheet.ciiva.com/16199/dcrcwe3-16199063.pdf?src-supplier=Future+Electronics; ComponentLink7URL: https://datasheet.ciiva.com/16725/70201119-16725175.pdf?src-supplier=Allied+Electronics; ComponentLink7Description: https://datasheet.ciiva.com/16725/70201119-16725175.pdf?src-supplier=Allied+Electronics; ComponentLink8URL: https://datasheet.ciiva.com/26316/fld-crcw-e3-data-en-26316615.pdf?src-supplier=Distrelec; ComponentLink8Description: https://datasheet.ciiva.com/26316/fld-crcw-e3-data-en-26316615.pdf?src-supplier=Distrelec; ComponentLink9URL: https://datasheet.ciiva.com/5544/dcrcwe3-109170-5544344.pdf?src-supplier=Mouser; ComponentLink9Description: https://datasheet.ciiva.com/5544/dcrcwe3-109170-5544344.pdf?src-supplier=Mouser; ComponentLink10URL: https://datasheet.ciiva.com/7841/1720486-7841816.pdf?src-supplier=Element14; ComponentLink10Description: https://datasheet.ciiva.com/7841/1720486-7841816.pdf?src-supplier=Element14; ComponentLink11URL: https://datasheet.ciiva.com/7841/1720486-7841817.pdf?src-supplier=Element14; ComponentLink11Description: https://datasheet.ciiva.com/7841/1720486-7841817.pdf?src-supplier=Element14; ComponentLink12URL: https://datasheet.ciiva.com/7841/125364-7841818.pdf?src-supplier=Element14; ComponentLink12Description: https://datasheet.ciiva.com/7841/125364-7841818.pdf?src-supplier=Element14; ComponentLink13URL: https://datasheet.ciiva.com/16721/70201119-16721450.pdf?src-supplier=Allied+Electronics; ComponentLink13Description: https://datasheet.ciiva.com/16721/70201119-16721450.pdf?src-supplier=Allied+Electronics; Supplier Part Number 1: 541-0.0GCT-ND

## Sheet CONNECTOR_A.SchDoc: =project_title
size Tabloid; CompanyName: Luxonis Holding; DrawnBy: Brian Weinstein; Organization: Luxonis Holding; Address1: 1925 Harmony Park Drive; Address2: Westminster, CO; Address3: 80234; Address4: United States; DocumentNumber: D2098000; Revision: R4M1E3; SheetNumber: 5; SheetTotal: 12
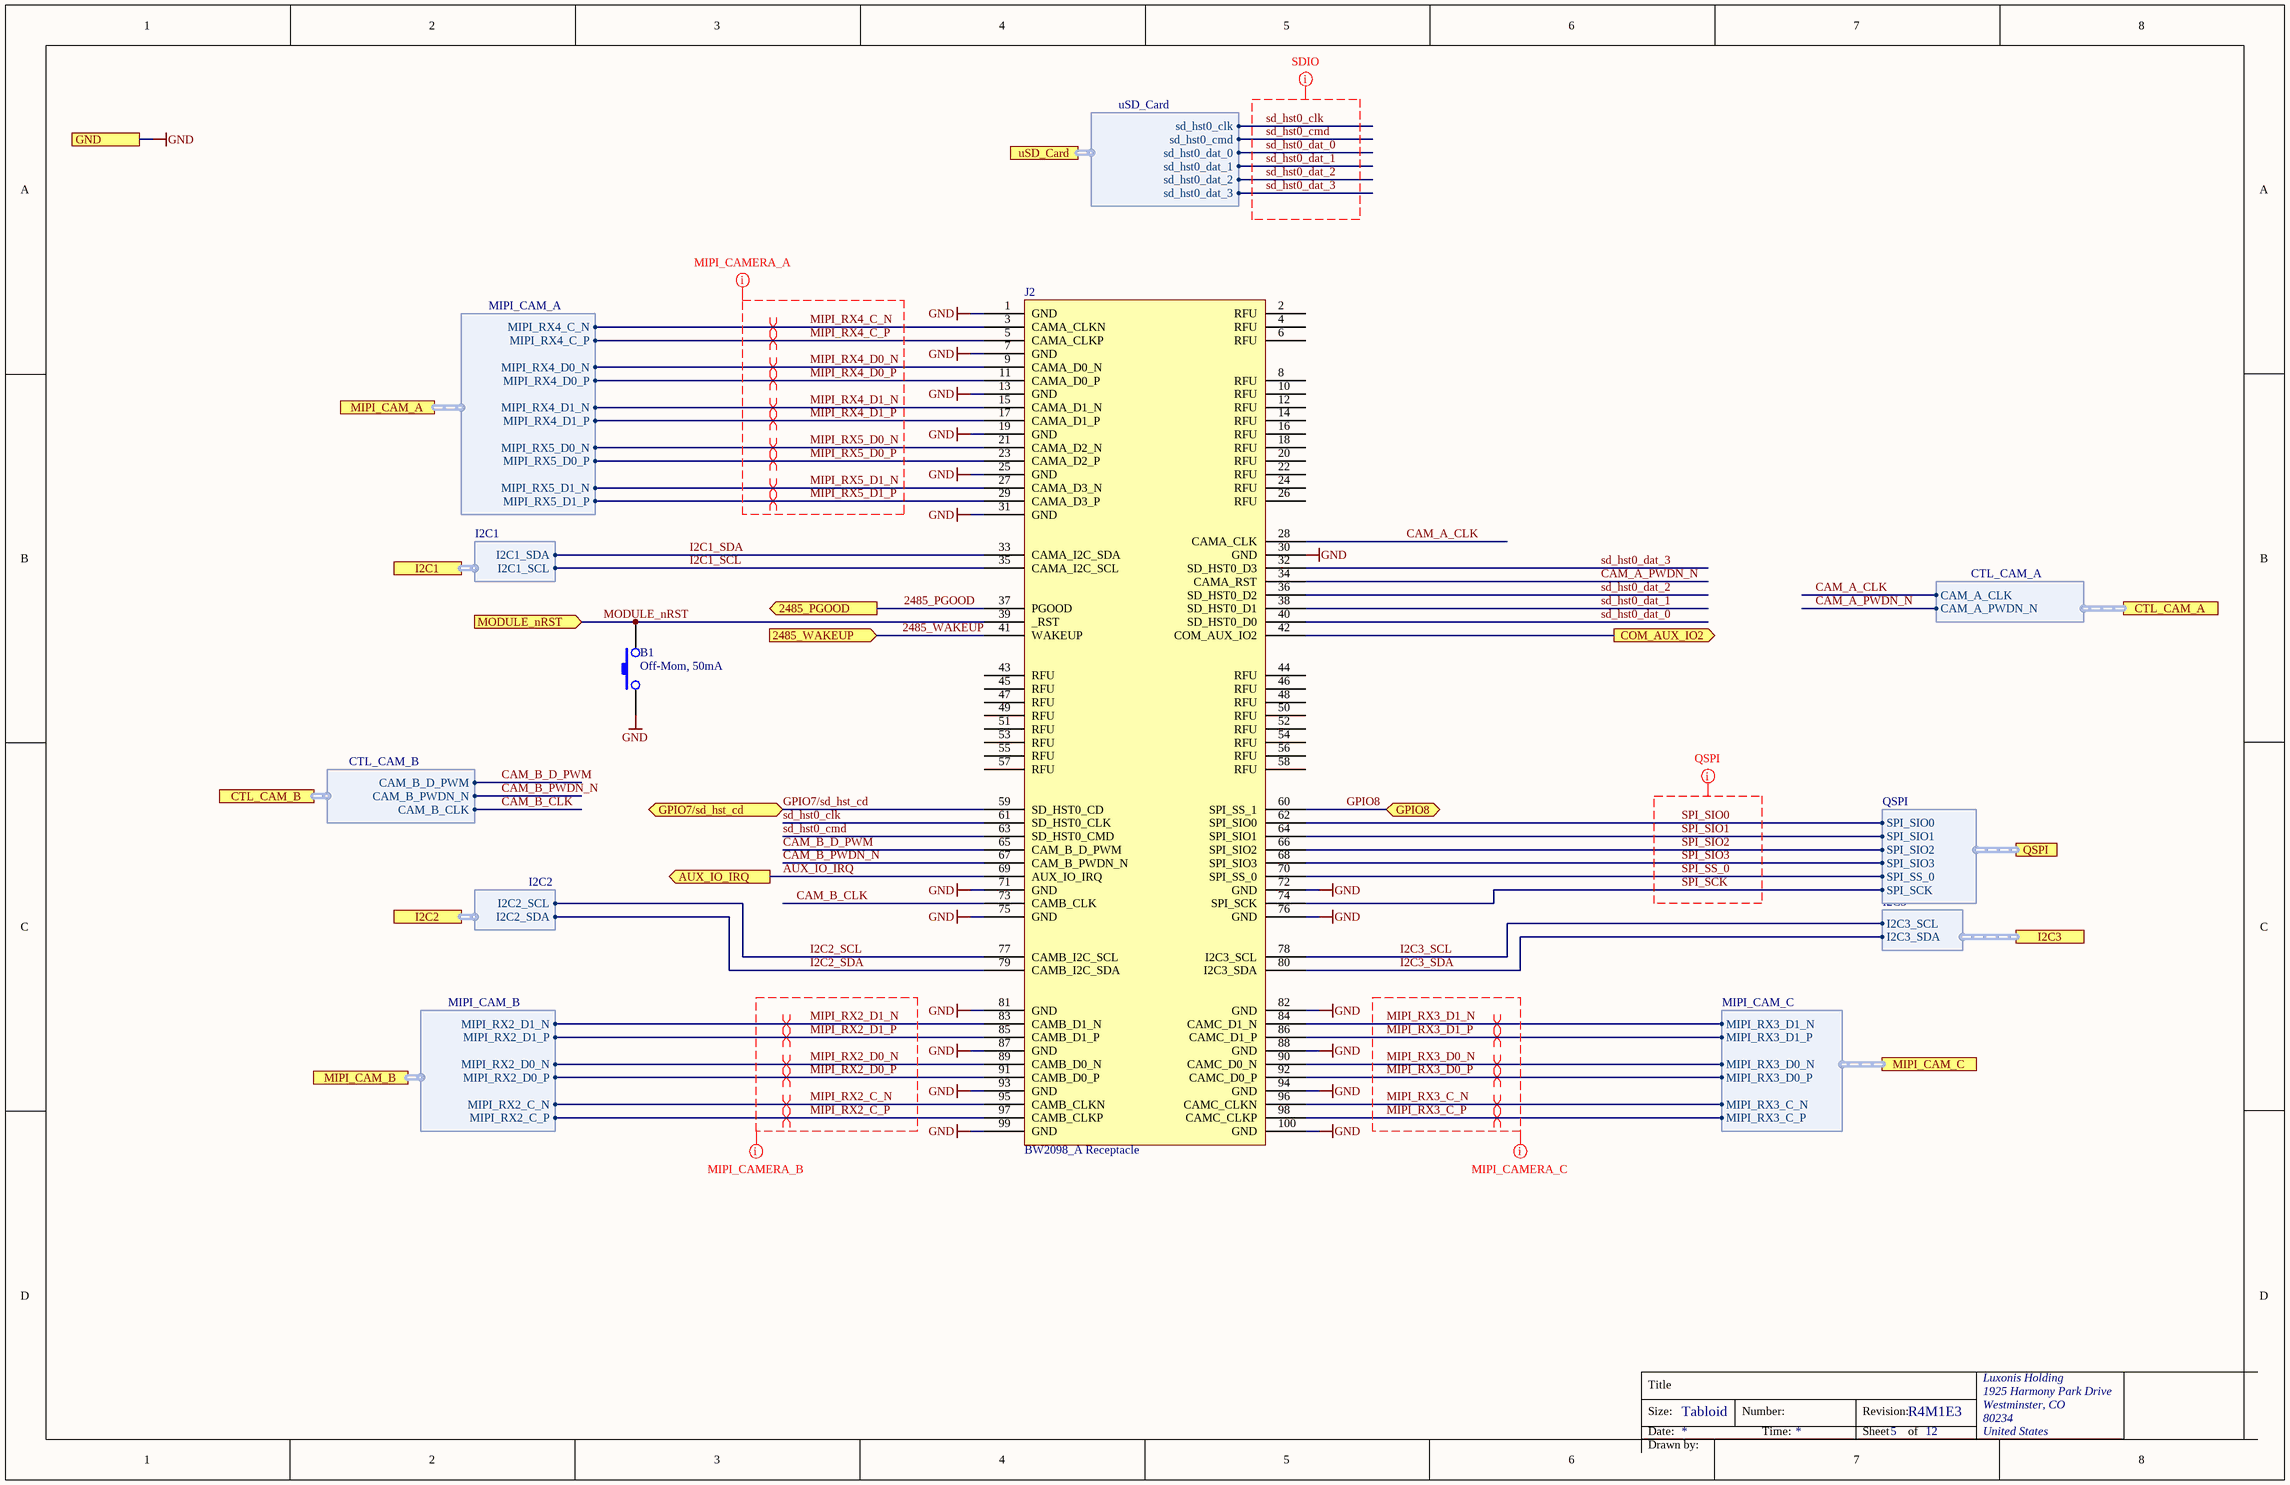
[diagram p3: CONNECTOR_A.SchDoc]

### Parts
B1  Off-Mom, 50mA  [DTSM-32N-V]
J2  BW2098_A Receptacle  [DF40HC-3.0-100DS-0.4V_minpad]

### Ports
2485_PGOOD (out), 2485_WAKEUP (in), AUX_IO_IRQ (out), COM_AUX_IO2 (out), CTL_CAM_A (harness CTL_CAM_A), CTL_CAM_B (harness CTL_CAM_B), GND, GPIO7/sd_hst_cd (bidir), GPIO8 (bidir), I2C1 (harness I2C1), I2C2 (harness I2C2), I2C3 (harness I2C3), MIPI_CAM_A (harness MIPI_CAM_A), MIPI_CAM_B (harness MIPI_CAM_B), MIPI_CAM_C (harness MIPI_CAM_C), MODULE_nRST (in), QSPI (harness QSPI), uSD_Card (harness uSD_Card)

### Harnesses
MIPI_CAM_B: MIPI_RX2_C_P, MIPI_RX2_C_N, MIPI_RX2_D0_P, MIPI_RX2_D0_N, MIPI_RX2_D1_P, MIPI_RX2_D1_N
MIPI_CAM_A: MIPI_RX4_C_N, MIPI_RX4_C_P, MIPI_RX4_D0_N, MIPI_RX4_D0_P, MIPI_RX4_D1_N, MIPI_RX4_D1_P, MIPI_RX5_D0_N, MIPI_RX5_D0_P, MIPI_RX5_D1_N, MIPI_RX5_D1_P
MIPI_CAM_C: MIPI_RX3_C_P, MIPI_RX3_C_N, MIPI_RX3_D0_P, MIPI_RX3_D0_N, MIPI_RX3_D1_P, MIPI_RX3_D1_N
I2C2: I2C2_SDA, I2C2_SCL
I2C1: I2C1_SDA, I2C1_SCL
CTL_CAM_B: CAM_B_PWDN_N, CAM_B_D_PWM, CAM_B_CLK
I2C3: I2C3_SDA, I2C3_SCL
QSPI: SPI_SCK, SPI_SIO0, SPI_SIO1, SPI_SIO2, SPI_SIO3, SPI_SS_0
CTL_CAM_A: CAM_A_PWDN_N, CAM_A_CLK
uSD_Card: sd_hst0_clk, sd_hst0_cmd, sd_hst0_dat_0, sd_hst0_dat_1, sd_hst0_dat_2, sd_hst0_dat_3

### Nets
GND: B1.1 J2.1(GND) J2.7(GND) J2.13(GND) J2.19(GND) J2.25(GND) J2.30(GND) J2.31(GND) J2.71(GND) J2.72(GND) J2.75(GND) J2.76(GND) J2.81(GND) J2.82(GND) J2.87(GND) J2.88(GND) J2.93(GND) J2.94(GND) J2.99(GND) J2.100(GND) ; port GND
2485_PGOOD: J2.37(PGOOD) ; port 2485_PGOOD
2485_WAKEUP: J2.41(WAKEUP) ; port 2485_WAKEUP
AUX_IO_IRQ: J2.69(AUX_IO_IRQ) ; port AUX_IO_IRQ
CAM_A_CLK: J2.28(CAMA_CLK) ; port CTL_CAM_A.CAM_A_CLK
CAM_A_PWDN_N: J2.34(CAMA_RST) ; port CTL_CAM_A.CAM_A_PWDN_N
CAM_B_CLK: J2.73(CAMB_CLK) ; port CTL_CAM_B.CAM_B_CLK
CAM_B_D_PWM: J2.65(CAM_B_D_PWM) ; port CTL_CAM_B.CAM_B_D_PWM
CAM_B_PWDN_N: J2.67(CAM_B_PWDN_N) ; port CTL_CAM_B.CAM_B_PWDN_N
GPIO7/sd_hst_cd: J2.59(SD_HST0_CD) ; port GPIO7/sd_hst_cd
GPIO8: J2.60(SPI_SS_1) ; port GPIO8
I2C1_SCL: J2.35(CAMA_I2C_SCL) ; port I2C1.I2C1_SCL
I2C1_SDA: J2.33(CAMA_I2C_SDA) ; port I2C1.I2C1_SDA
I2C2_SCL: J2.77(CAMB_I2C_SCL) ; port I2C2.I2C2_SCL
I2C2_SDA: J2.79(CAMB_I2C_SDA) ; port I2C2.I2C2_SDA
I2C3_SCL: J2.78(I2C3_SCL) ; port I2C3.I2C3_SCL
I2C3_SDA: J2.80(I2C3_SDA) ; port I2C3.I2C3_SDA
MIPI_RX2_C_N: J2.95(CAMB_CLKN) ; port MIPI_CAM_B.MIPI_RX2_C_N
MIPI_RX2_C_P: J2.97(CAMB_CLKP) ; port MIPI_CAM_B.MIPI_RX2_C_P
MIPI_RX2_D0_N: J2.89(CAMB_D0_N) ; port MIPI_CAM_B.MIPI_RX2_D0_N
MIPI_RX2_D0_P: J2.91(CAMB_D0_P) ; port MIPI_CAM_B.MIPI_RX2_D0_P
MIPI_RX2_D1_N: J2.83(CAMB_D1_N) ; port MIPI_CAM_B.MIPI_RX2_D1_N
MIPI_RX2_D1_P: J2.85(CAMB_D1_P) ; port MIPI_CAM_B.MIPI_RX2_D1_P
MIPI_RX3_C_N: J2.96(CAMC_CLKN) ; port MIPI_CAM_C.MIPI_RX3_C_N
MIPI_RX3_C_P: J2.98(CAMC_CLKP) ; port MIPI_CAM_C.MIPI_RX3_C_P
MIPI_RX3_D0_N: J2.90(CAMC_D0_N) ; port MIPI_CAM_C.MIPI_RX3_D0_N
MIPI_RX3_D0_P: J2.92(CAMC_D0_P) ; port MIPI_CAM_C.MIPI_RX3_D0_P
MIPI_RX3_D1_N: J2.84(CAMC_D1_N) ; port MIPI_CAM_C.MIPI_RX3_D1_N
MIPI_RX3_D1_P: J2.86(CAMC_D1_P) ; port MIPI_CAM_C.MIPI_RX3_D1_P
MIPI_RX4_C_N: J2.3(CAMA_CLKN) ; port MIPI_CAM_A.MIPI_RX4_C_N  [project net MIPI_C_N]
MIPI_RX4_C_P: J2.5(CAMA_CLKP) ; port MIPI_CAM_A.MIPI_RX4_C_P  [project net MIPI_C_P]
MIPI_RX4_D0_N: J2.9(CAMA_D0_N) ; port MIPI_CAM_A.MIPI_RX4_D0_N  [project net MIPI_D0_N]
MIPI_RX4_D0_P: J2.11(CAMA_D0_P) ; port MIPI_CAM_A.MIPI_RX4_D0_P  [project net MIPI_D0_P]
MIPI_RX4_D1_N: J2.15(CAMA_D1_N) ; port MIPI_CAM_A.MIPI_RX4_D1_N  [project net MIPI_D1_N]
MIPI_RX4_D1_P: J2.17(CAMA_D1_P) ; port MIPI_CAM_A.MIPI_RX4_D1_P  [project net MIPI_D1_P]
MIPI_RX5_D0_N: J2.21(CAMA_D2_N) ; port MIPI_CAM_A.MIPI_RX5_D0_N  [project net MIPI_D2_N]
MIPI_RX5_D0_P: J2.23(CAMA_D2_P) ; port MIPI_CAM_A.MIPI_RX5_D0_P  [project net MIPI_D2_P]
MIPI_RX5_D1_N: J2.27(CAMA_D3_N) ; port MIPI_CAM_A.MIPI_RX5_D1_N  [project net MIPI_D3_N]
MIPI_RX5_D1_P: J2.29(CAMA_D3_P) ; port MIPI_CAM_A.MIPI_RX5_D1_P  [project net MIPI_D3_P]
MODULE_nRST: B1.2 J2.39(_RST) ; port MODULE_nRST
sd_hst0_clk: J2.61(SD_HST0_CLK) ; port uSD_Card.sd_hst0_clk
sd_hst0_cmd: J2.63(SD_HST0_CMD) ; port uSD_Card.sd_hst0_cmd
sd_hst0_dat_0: J2.40(SD_HST0_D0) ; port uSD_Card.sd_hst0_dat_0
sd_hst0_dat_1: J2.38(SD_HST0_D1) ; port uSD_Card.sd_hst0_dat_1
sd_hst0_dat_2: J2.36(SD_HST0_D2) ; port uSD_Card.sd_hst0_dat_2
sd_hst0_dat_3: J2.32(SD_HST0_D3) ; port uSD_Card.sd_hst0_dat_3
SPI_SCK: J2.74(SPI_SCK) ; port QSPI.SPI_SCK
SPI_SIO0: J2.62(SPI_SIO0) ; port QSPI.SPI_SIO0
SPI_SIO1: J2.64(SPI_SIO1) ; port QSPI.SPI_SIO1
SPI_SIO2: J2.66(SPI_SIO2) ; port QSPI.SPI_SIO2
SPI_SIO3: J2.68(SPI_SIO3) ; port QSPI.SPI_SIO3
SPI_SS_0: J2.70(SPI_SS_0) ; port QSPI.SPI_SS_0
NetJ2_42: J2.42(COM_AUX_IO2) ; port COM_AUX_IO2

Not connected (* = marked no-connect by the designer): J2 2(RFU) 4(RFU) 6(RFU) 8(RFU) 10(RFU) 12(RFU) 14(RFU) 16(RFU) 18(RFU) 20(RFU) 22(RFU) 24(RFU) 26(RFU) 43(RFU) 44(RFU) 45(RFU) 46(RFU) 47(RFU) 48(RFU) 49(RFU) 50(RFU) 51(RFU) 52(RFU) 53(RFU) 54(RFU) 55(RFU) 56(RFU) 57(RFU) 58(RFU)

### Layout directives
differential pair; differential pair class 100ohm: MIPI_C_N, MIPI_C_P, MIPI_D0_N, MIPI_D0_P, MIPI_D1_N, MIPI_D1_P, MIPI_D2_N, MIPI_D2_P, MIPI_D3_N, MIPI_D3_P, MIPI_RX2_C_N, MIPI_RX2_C_P, MIPI_RX2_D0_N, MIPI_RX2_D0_P, MIPI_RX2_D1_N, MIPI_RX2_D1_P, MIPI_RX3_C_N, MIPI_RX3_C_P, MIPI_RX3_D0_N, MIPI_RX3_D0_P, MIPI_RX3_D1_N, MIPI_RX3_D1_P
net class MIPI_CAM_A: MIPI_RX4_C_N, MIPI_RX4_C_P, MIPI_RX4_D0_N, MIPI_RX4_D0_P, MIPI_RX4_D1_N, MIPI_RX4_D1_P, MIPI_RX5_D0_N, MIPI_RX5_D0_P, MIPI_RX5_D1_N, MIPI_RX5_D1_P
net class MIPI_CAM_C: MIPI_RX3_C_N, MIPI_RX3_C_P, MIPI_RX3_D0_N, MIPI_RX3_D0_P, MIPI_RX3_D1_N, MIPI_RX3_D1_P
net class MIPI_CAM_B: MIPI_RX2_C_N, MIPI_RX2_C_P, MIPI_RX2_D0_N, MIPI_RX2_D0_P, MIPI_RX2_D1_N, MIPI_RX2_D1_P
net class QSPI: SPI_SCK, SPI_SIO0, SPI_SIO1, SPI_SIO2, SPI_SIO3, SPI_SS_0
net class SDIO: sd_hst0_clk, sd_hst0_cmd, sd_hst0_dat_0, sd_hst0_dat_1, sd_hst0_dat_2, sd_hst0_dat_3

### Notes on the sheet
- Title
- Size:
- Date:
- Tabloid
- Number:
- Time:
- Revision:
- Sheet
- of
- Drawn by:

### Library data of the parts
B1 = DTSM-32N-V: SWITCH TACTILE SMT 3.5mm * 6mm , brown 160gf; Manufacturer 1: Diptronics; Manufacturer Part Number 1: DTSM-32N-V-T/R; Supplier 1: Mouser; Stock 1: 3199; Pricing 1: 1=0.38000, 10=0.38000, 50=0.31000, 100=0.28200, 500=0.25600, 1000=0.23600, 1600=0.20900, 4800=0.18800, 9600=0.17300, 10000=0.17300, 24000=0.16100 (USD); RoHS: No; Min Operating Temperature: -30°C; Max Operating Temperature: 80°C; Length: 6mm; Height: 5mm; Width: 3.5mm; ComponentLink1URL: https://datasheet.ciiva.com/29188/708548-da-01-en-tastschalter-smd-dtsm-32n-v-tr-1600st-29188823.pdf?src-supplier=Conrad; ComponentLink1Description: https://datasheet.ciiva.com/29188/708548-da-01-en-tastschalter-smd-dtsm-32n-v-tr-1600st-29188823.pdf?src-supplier=Conrad; Supplier Part Number 1: 113-DTSM32NVTR
J2 = DF40HC(3.0)-100DS-0.4V_BW2098_A: CONN RCPT 100POS 0.4MM SMD GOLD BW2098_A Receptacle; Manufacturer 1: Hirose; Number of Positions: 100; Pitch: 0.016inch; System: Connector; RoHS: Yes; Mount: Surface Mount; Contact Plating: Gold; Packaging: Tape and Reel; Number of Rows: 2; Package Quantity: 1000; Connector Type: Receptacle; Lead Free: Lead Free; ComponentLink1URL: https://datasheet.ciiva.com/46636/ed-df40-20140305-46636517.pdf?src-supplier=Digi-Key; ComponentLink1Description: https://datasheet.ciiva.com/46636/ed-df40-20140305-46636517.pdf?src-supplier=Digi-Key; ComponentLink2URL: https://datasheet.ciiva.com/18562/ed-df40-20140305-18562189.pdf?src-supplier=Digi-Key; ComponentLink2Description: https://datasheet.ciiva.com/18562/ed-df40-20140305-18562189.pdf?src-supplier=Digi-Key; ComponentLink3URL: https://datasheet.ciiva.com/13559/ed-df40-20140305-13559540.pdf?src-supplier=Mouser; ComponentLink3Description: https://datasheet.ciiva.com/13559/ed-df40-20140305-13559540.pdf?src-supplier=Mouser; ComponentLink4URL: https://datasheet.ciiva.com/18562/ed-df40-20140305-18562462.pdf?src-supplier=Digi-Key; ComponentLink4Description: https://datasheet.ciiva.com/18562/ed-df40-20140305-18562462.pdf?src-supplier=Digi-Key; Supplier 1: Mouser; Stock 1: 2172; Pricing 1: 1=2.54000, 10=2.26000, 25=2.07000, 50=2.07000, 100=1.98000, 250=1.79000, 500=1.65000, 1000=1.41000, 3000=1.32000, 6000=1.23000, 10000=1.23000 (USD); Supplier 2: Mouser; Manufacturer 2: Hirose; Manufacturer Part Number 2: DF40HC(3.0)-100DS-0.4V(58); Stock 2: 2078; Pricing 2: 1=2.50000, 10=2.40000, 25=2.10000, 50=2.10000, 100=2.00000, 250=1.76000, 500=1.71000, 1000=1.45000, 2000=1.36000, 5000=1.31000, 10000=1.31000 (USD); Supplier Part Number 1: 798-DF40HC30100DS451; Supplier Part Number 2: 798-DF40HC30100DS458